# Altium schematic sheet 8.HDMI2.SchDoc
size 297 x 209 mm; SheetNumber: 8; SheetTotal: 13
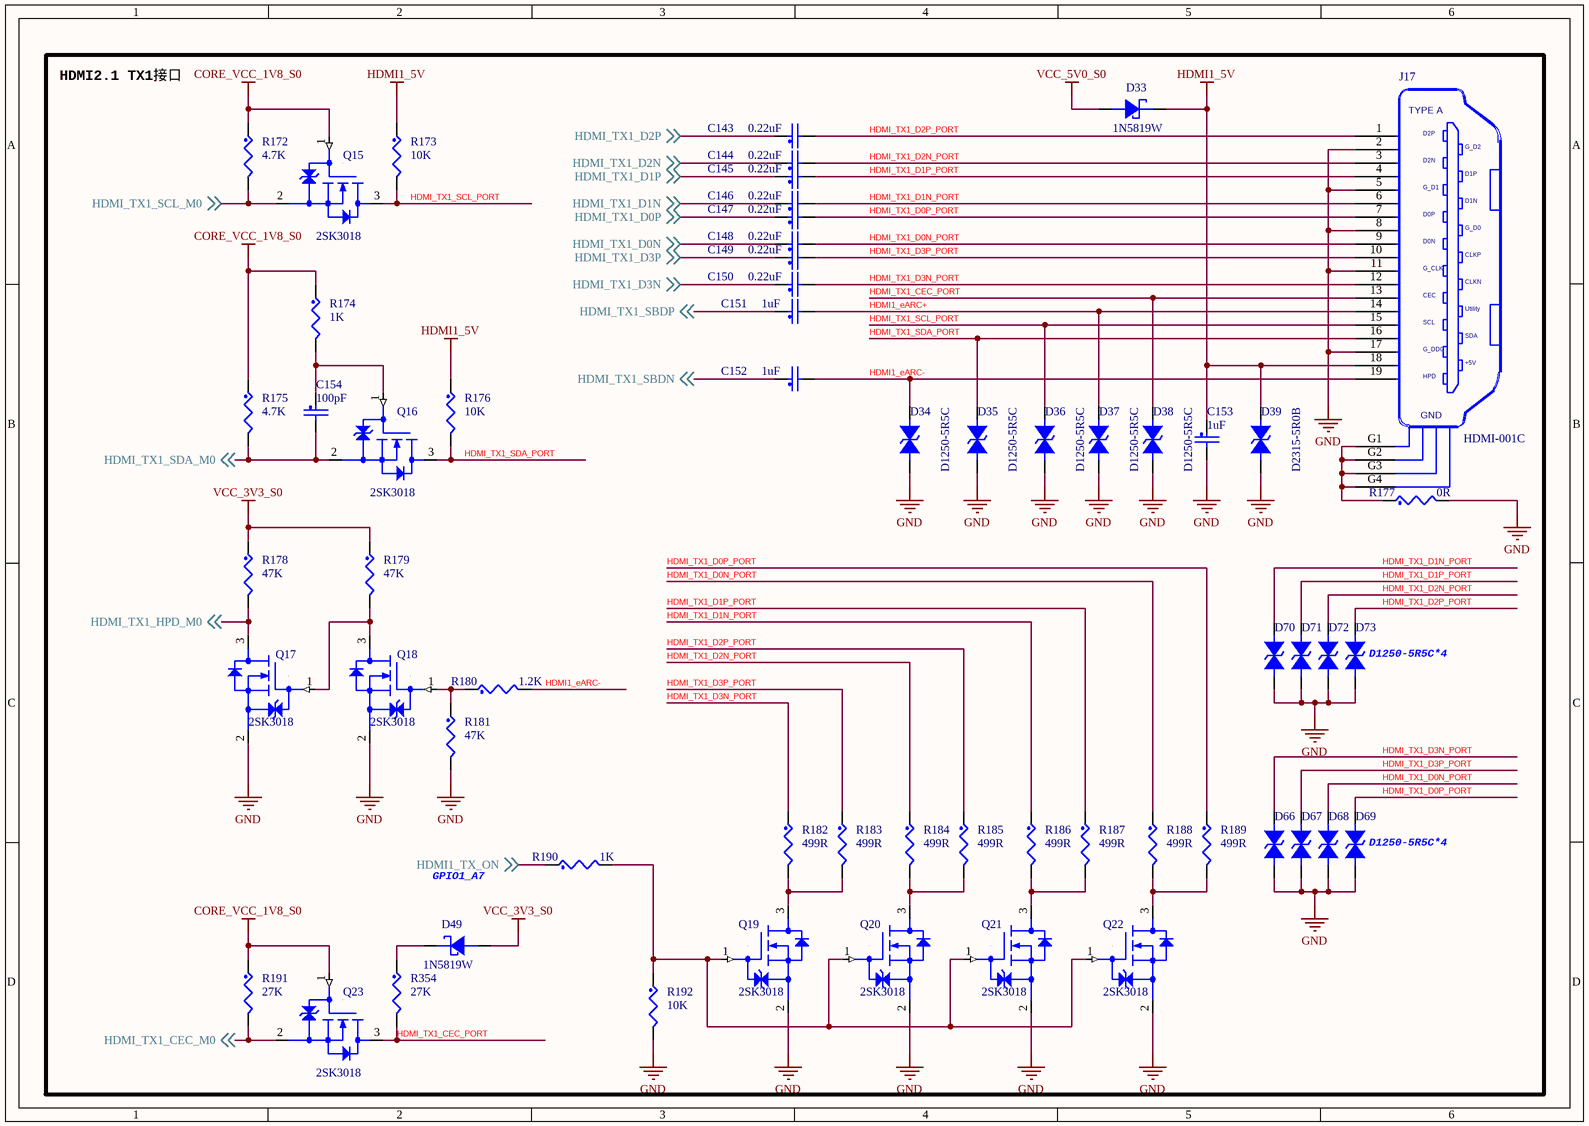
[diagram p0: 8.HDMI2.SchDoc]

## Parts
C143  0.22uF  [C0402]
C144  0.22uF  [C0402]
C145  0.22uF  [C0402]
C146  0.22uF  [C0402]
C147  0.22uF  [C0402]
C148  0.22uF  [C0402]
C149  0.22uF  [C0402]
C150  0.22uF  [C0402]
C151  1uF  [C0402]
C152  1uF  [C0402]
C153  1uF  [C0402]
C154  100pF  [C0402]
D33  1N5819W  [SOD-123]
D34  D1250-5R5C  [esd0402]
D35  D1250-5R5C  [esd0402]
D36  D1250-5R5C  [esd0402]
D37  D1250-5R5C  [esd0402]
D38  D1250-5R5C  [esd0402]
D39  D2315-5R0B  [esd0402]
D49  1N5819W  [SOD-123]
D66  D1250-5R5C  [esd0402]  (value not drawn)
D67  D1250-5R5C  [esd0402]  (value not drawn)
D68  D1250-5R5C  [esd0402]  (value not drawn)
D69  D1250-5R5C  [esd0402]  (value not drawn)
D70  D1250-5R5C  [esd0402]  (value not drawn)
D71  D1250-5R5C  [esd0402]  (value not drawn)
D72  D1250-5R5C  [esd0402]  (value not drawn)
D73  D1250-5R5C  [esd0402]  (value not drawn)
J17  HDMI-001C  [HDMI-SMD]
Q15  2SK3018  [SOT23]
Q16  2SK3018  [SOT23]
Q17  2SK3018  [SOT23]
Q18  2SK3018  [SOT23]
Q19  2SK3018  [SOT23]
Q20  2SK3018  [SOT23]
Q21  2SK3018  [SOT23]
Q22  2SK3018  [SOT23]
Q23  2SK3018  [SOT23]
R172  4.7K  [R0402]
R173  10K  [R0402]
R174  1K  [R0402]
R175  4.7K  [R0402]
R176  10K  [R0402]
R177  0R  [R0402]
R178  47K  [R0402]
R179  47K  [R0402]
R180  1.2K  [R0402]
R181  47K  [R0402]
R182  499R  [R0402]
R183  499R  [R0402]
R184  499R  [R0402]
R185  499R  [R0402]
R186  499R  [R0402]
R187  499R  [R0402]
R188  499R  [R0402]
R189  499R  [R0402]
R190  1K  [R0402]
R191  27K  [R0402]
R192  10K  [R0402]
R354  27K  [R0402]

## Nets
CORE_VCC_1V8_S0: Q15.1(GATE) Q23.1(GATE) R172.1 R174.1 R175.1 R191.1
GND: C153.2 D34.1 D35.1 D36.1 D37.1 D38.1 D39.1 D66.1 D67.1 D68.1 D69.1 D70.1 D71.1 D72.1 D73.1 J17.2 J17.5 J17.8 J17.11 J17.17 Q17.2(SOURCE) Q18.2(SOURCE) Q19.2(SOURCE) Q20.2(SOURCE) Q21.2(SOURCE) Q22.2(SOURCE) R177.2 R181.2 R192.2
HDMI1_5V: C153.1 D33.1 D39.2 J17.18 R173.1 R176.1
VCC_3V3_S0: D49.2 R178.1 R179.1
VCC_5V0_S0: D33.2
HDMI1_eARC+: C151.2 D37.2 J17.14
HDMI1_eARC-: C152.2 D34.2 J17.19 R180.2
HDMI1_TX_ON: R190.1 ; off-sheet HDMI1_TX_ON
HDMI_TX1_CEC_M0: Q23.2(SOURCE) R191.2 ; off-sheet HDMI_TX1_CEC_M0
HDMI_TX1_CEC_PORT: D38.2 J17.13 Q23.3(DRAIN) R354.2
HDMI_TX1_D0N: C148.1 ; off-sheet HDMI_TX1_D0N
HDMI_TX1_D0N_PORT: C148.2 D68.2 J17.9 R188.1
HDMI_TX1_D0P: C147.1 ; off-sheet HDMI_TX1_D0P
HDMI_TX1_D0P_PORT: C147.2 D69.2 J17.7 R189.1
HDMI_TX1_D1N: C146.1 ; off-sheet HDMI_TX1_D1N
HDMI_TX1_D1N_PORT: C146.2 D70.2 J17.6 R186.1
HDMI_TX1_D1P: C145.1 ; off-sheet HDMI_TX1_D1P
HDMI_TX1_D1P_PORT: C145.2 D71.2 J17.4 R187.1
HDMI_TX1_D2N: C144.1 ; off-sheet HDMI_TX1_D2N
HDMI_TX1_D2N_PORT: C144.2 D72.2 J17.3 R184.1
HDMI_TX1_D2P: C143.1 ; off-sheet HDMI_TX1_D2P
HDMI_TX1_D2P_PORT: C143.2 D73.2 J17.1 R185.1
HDMI_TX1_D3N: C150.1 ; off-sheet HDMI_TX1_D3N
HDMI_TX1_D3N_PORT: C150.2 D66.2 J17.12 R182.1
HDMI_TX1_D3P: C149.1 ; off-sheet HDMI_TX1_D3P
HDMI_TX1_D3P_PORT: C149.2 D67.2 J17.10 R183.1
HDMI_TX1_HPD_M0: Q17.3(DRAIN) R178.2 ; off-sheet HDMI_TX1_HPD_M0
HDMI_TX1_SBDN: C152.1 ; off-sheet HDMI_TX1_SBDN
HDMI_TX1_SBDP: C151.1 ; off-sheet HDMI_TX1_SBDP
HDMI_TX1_SCL_M0: Q15.2(SOURCE) R172.2 ; off-sheet HDMI_TX1_SCL_M0
HDMI_TX1_SCL_PORT: D36.2 J17.15 Q15.3(DRAIN) R173.2
HDMI_TX1_SDA_M0: C154.2 Q16.2(SOURCE) R175.2 ; off-sheet HDMI_TX1_SDA_M0
HDMI_TX1_SDA_PORT: D35.2 J17.16 Q16.3(DRAIN) R176.2
NetC154_1: C154.1 Q16.1(GATE) R174.2
NetD49_1: D49.1 R354.1
NetJ17_G1: J17.G1 J17.G2 J17.G3 J17.G4 R177.1
NetQ17_1: Q17.1(GATE) Q18.3(DRAIN) R179.2
NetQ18_1: Q18.1(GATE) R180.1 R181.1
NetQ19_1: Q19.1(GATE) Q20.1(GATE) Q21.1(GATE) Q22.1(GATE) R190.2 R192.1
NetQ19_3: Q19.3(DRAIN) R182.2 R183.2
NetQ20_3: Q20.3(DRAIN) R184.2 R185.2
NetQ21_3: Q21.3(DRAIN) R186.2 R187.2
NetQ22_3: Q22.3(DRAIN) R188.2 R189.2

## Notes on the sheet
- HDMI2.1 TX1接口
- (near D73) D1250-5R5C*4
- GPIO1_A7
- (near D69) D1250-5R5C*4
- (in symbol HDMI-001C) TYPE A; D2P; G_D2; D2N; D1P; G_D1; D1N; D0P; G_D0; D0N; CLKP; G_CLK; CLKN; CEC; Utility; SCL; SDA; G_DDC; +5V; HPD; GND

## Library data of the parts
C143-C154 = CAP_NP
D33 D49 = DIODE_SCHTKY
D34-D39 D66-D73 = DIODE BI-DIR TRIG
R172-R192 R354 = RES